# EAGLE schematic motorboard (EAGLE 8.0.1)
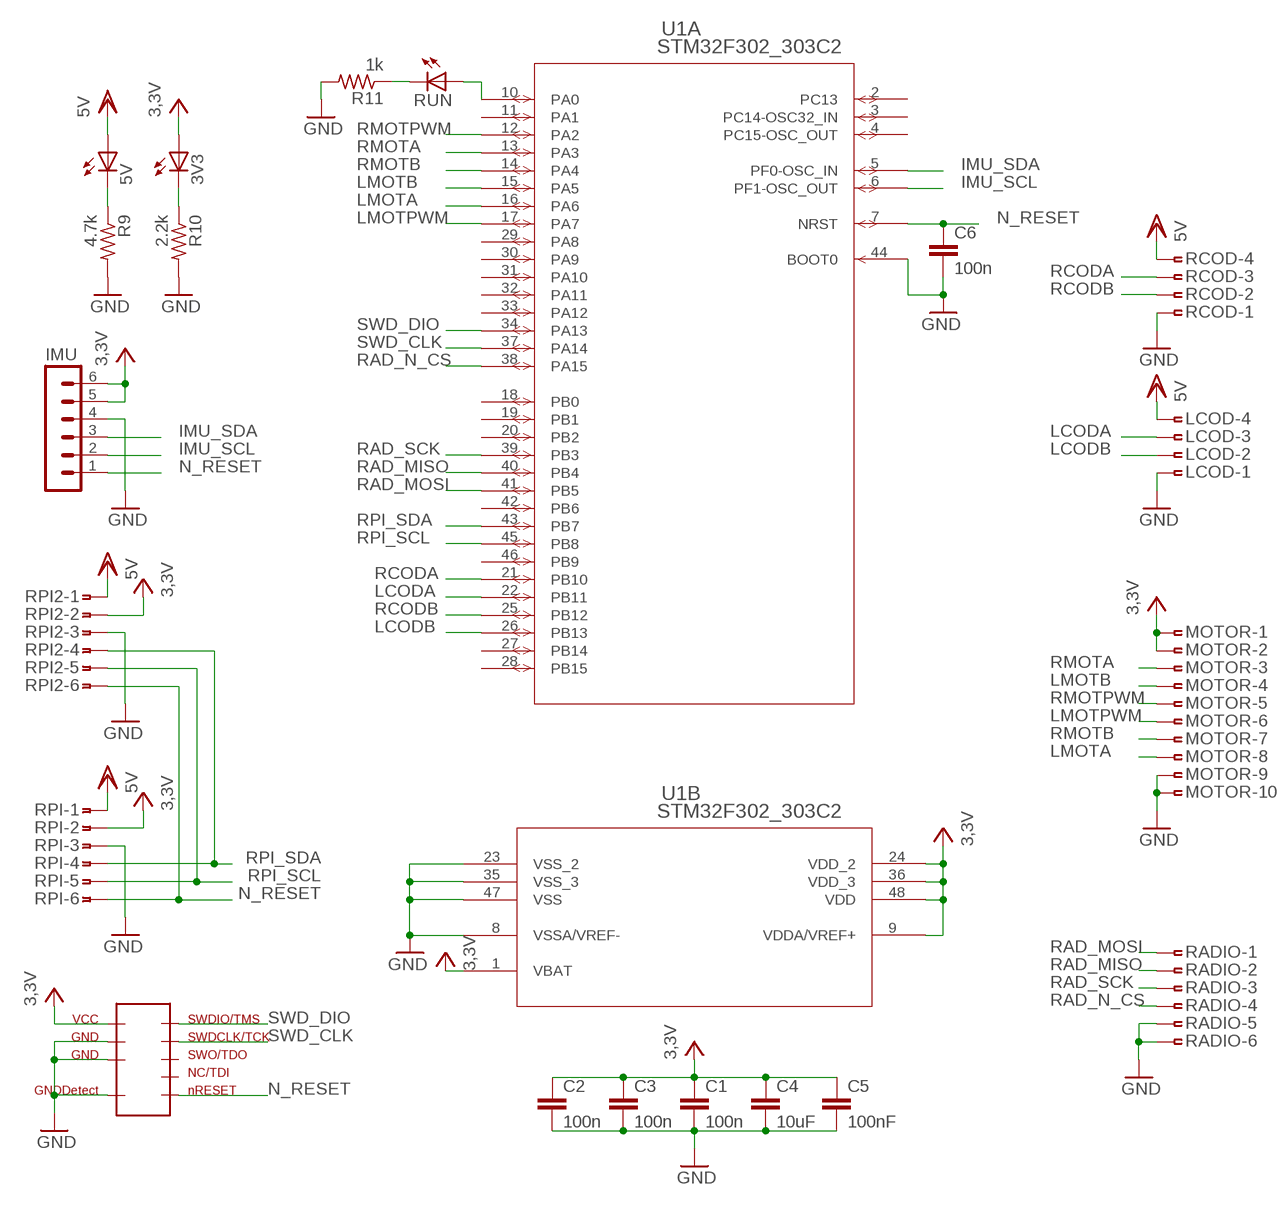
[diagram p0: schematic, sheet 1]

## Parts
3V3  LEDCHIPLED_0805  [CHIPLED_0805]
5V  LEDCHIPLED_0805  [CHIPLED_0805]
C1  100n  C-EUC0805  [C0805]
C2  100n  C-EUC0805  [C0805]
C3  100n  C-EUC0805  [C0805]
C4  10uF  C-EUC0805  [C0805]
C5  100nF  C-EUC0805  [C0805]
C6  100n  C-EUC0805  [C0805]
IMU  MA06-1  [MA06-1]
LCOD  SMDTOP-4  [SMDTOP4]
MOTOR  SMDTOP-10  [SMDTOP10]
R9  4.7k  R-US_M0805  [M0805]
R10  2.2k  R-US_M0805  [M0805]
R11  1k  R-US_M0805  [M0805]
RADIO  SMDTOP-6  [SMDTOP6]
RCOD  SMDTOP-4  [SMDTOP4]
RPI  SMDTOP-6  [SMDTOP6]
RPI2  SMDTOP-6  [SMDTOP6]
RUN  LEDCHIPLED_0805  [CHIPLED_0805]
U1  STM32F302_303C2  [LQFP48-7X7MM]
U$1  SWD/JTAG-_PINS  [SAMTEC_SHF-105-01-L-D-SM]

## Nets
GND: C1.2 C2.2 C3.2 C4.2 C5.2 C6.2 IMU.4 LCOD.1 MOTOR.9 MOTOR.10 R9.2 R10.2 R11.2 RADIO.5 RADIO.6 RCOD.1 RPI2.3 RPI.3 U1.8(B:VSSA/VREF-) U1.23(B:VSS_2) U1.35(B:VSS_3) U1.44(A:BOOT0) U1.47(B:VSS) U$1.P$3 U$1.P$5 U$1.P$9
IMU_SCL: IMU.2 U1.6(A:PF1-OSC_OUT)
IMU_SDA: IMU.3 U1.5(A:PF0-OSC_IN)
LCODA: LCOD.3 U1.22(A:PB11)
LCODB: LCOD.2 U1.26(A:PB13)
LMOTA: MOTOR.8 U1.16(A:PA6)
LMOTB: MOTOR.4 U1.15(A:PA5)
LMOTPWM: MOTOR.6 U1.17(A:PA7)
N$1: RUN.A U1.10(A:PA0)
N$9: R11.1 RUN.C
N$10: 5V.C R9.1
N$14: 3V3.C R10.1
N_RESET: C6.1 IMU.1 RPI2.6 RPI.6 U1.7(A:NRST) U$1.P$10
RAD_MISO: RADIO.2 U1.40(A:PB4)
RAD_MOSI: RADIO.1 U1.41(A:PB5)
RAD_N_CS: RADIO.4 U1.38(A:PA15)
RAD_SCK: RADIO.3 U1.39(A:PB3)
RCODA: RCOD.3 U1.21(A:PB10)
RCODB: RCOD.2 U1.25(A:PB12)
RMOTA: MOTOR.3 U1.13(A:PA3)
RMOTB: MOTOR.7 U1.14(A:PA4)
RMOTPWM: MOTOR.5 U1.12(A:PA2)
RPI_SCL: RPI2.5 RPI.5 U1.45(A:PB8)
RPI_SDA: RPI2.4 RPI.4 U1.43(A:PB7)
SWD_CLK: U1.37(A:PA14) U$1.P$4
SWD_DIO: U1.34(A:PA13) U$1.P$2
VCC: 3V3.A C1.1 C2.1 C3.1 C4.1 C5.1 IMU.5 IMU.6 MOTOR.1 MOTOR.2 RPI2.2 RPI.2 U1.1(B:VBAT) U1.9(B:VDDA/VREF+) U1.24(B:VDD_2) U1.36(B:VDD_3) U1.48(B:VDD) U$1.P$1 ; supply symbol labelled 3,3V
VDD: 5V.A LCOD.4 RCOD.4 RPI2.1 RPI.1 ; supply symbol labelled 5V
Unconnected: U1.2(A:PC13) U1.3(A:PC14-OSC32_IN) U1.4(A:PC15-OSC_OUT) U1.11(A:PA1) U1.18(A:PB0) U1.19(A:PB1) U1.20(A:PB2) U1.27(A:PB14) U1.28(A:PB15) U1.29(A:PA8) U1.30(A:PA9) U1.31(A:PA10) U1.32(A:PA11) U1.33(A:PA12) U1.42(A:PB6) U1.46(A:PB9) U$1.P$6 U$1.P$8

## Library data of the parts
3V3 5V RUN = adafruit:LED: LED OSRAM: - CHIPLED LG R971, LG N971, LY N971, LG Q971, LY Q971, LO R971, LY R971 LH N974, LH R974 LS Q976, LO Q976, LY Q976 LO Q996 - Hyper CHIPLED LW Q18S LB Q993, LB Q99A, LB R99A - SideLED LS A670, LO A670, LY A670, LG A670, LP A670 LB A673, LV A673, LT A673, LW A673 LH A674 LY A675 LS A676, LA A676, LO A676, LY A676, LW A676 LS A679, LY A679, LG A679 - Hyper Micro SIDELED® LS Y876, LA Y876, LO Y876, LY Y876 LT Y87S - SmartLED LW L88C, LW L88S LB L89C, LB L89S, LG L890 LS L89K, LO L89K, LY L89K LS L896, LA L896, LO L896, LY L896 - TOPLED LS T670, LO T670, LY T670, LG T670, LP T670 LSG T670, LSP T670, LSY T670, LOP T670, LYG T670 LG T671, LOG T671, LSG T671 LB T673, LV T673, LT T673, LW T673 LH T674 LS T676, LA T676, LO T676, LY T676, LB T676, LH T676, LSB T676, LW T676 LB T67C, LV T67C, LT T67C, LS T67K, LO T67K, LY T67K, LW E67C LS E67B, LA E67B, LO E67B, LY E67B, LB E67C, LV E67C, LT E67C LW T67C LS T679, LY T679, LG T679 LS T770, LO T770, LY T770, LG T770, LP T770 LB T773, LV T773, LT T773, LW T773 LH T774 LS E675, LA E675, LY E675, LS T675 LS T776, LA T776, LO T776, LY T776, LB T776 LHGB T686 LT T68C, LB T68C - Hyper Mini TOPLED® LB M676 - Mini TOPLED Santana® LG M470 LS M47K, LO M47K, LY M47K Source: http://www.osram.convergy.de/
C1-C6 = resistor:C-EU: CAPACITOR, European symbol
IMU = con-lstb:MA06-1: PIN HEADER; OC_FARNELL: unknown; OC_NEWARK: unknown
LCOD RCOD = con-amp:SMDTOP-4: AMP connector
MOTOR = con-amp:SMDTOP-10: AMP connector
R9-R11 = resistor:R-US_: RESISTOR, American symbol
RADIO RPI RPI2 = con-amp:SMDTOP-6: AMP connector
U1 = STM32F3xx:STM32F302_303C2; COPYRIGHT: Copyright C 2016 Accelerated Designs. All rights reserved; MANUFACTURER_PART_NUMBER: stm32f302_303c2; VENDOR: STMicroelectronics
U$1 = con-SWD:SWD/JTAG-_PINS